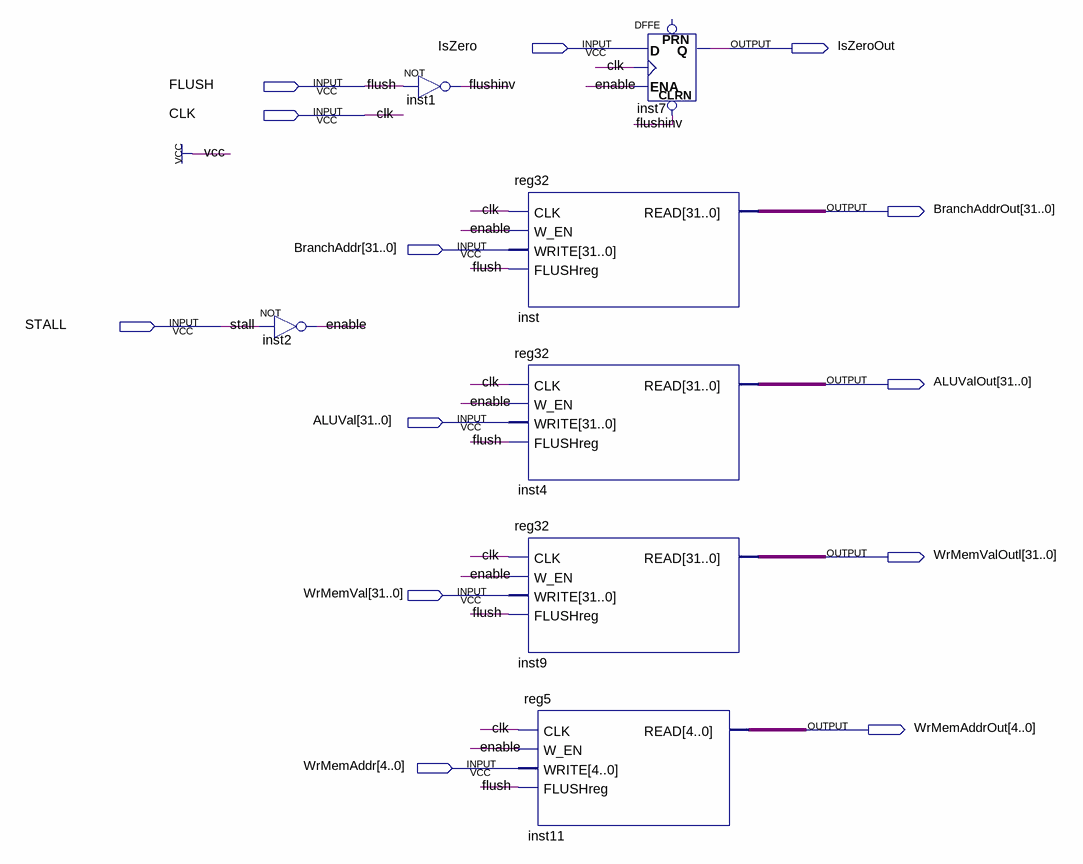
[diagram p0: schematic sheet]
// Quartus schematic EX-MW_barrier.bdf as structural Verilog: 7 symbols, 13 pins
module \EX-MW_barrier  (
  input  IsZero,
  input  FLUSH,
  input  CLK,
  input  [31:0] BranchAddr,
  input  STALL,
  input  [31:0] ALUVal,
  input  [31:0] WrMemVal,
  input  [4:0] WrMemAddr,
  output IsZeroOut,
  output [31:0] BranchAddrOut,
  output [31:0] ALUValOut,
  output [31:0] WrMemValOutl,
  output [4:0] WrMemAddrOut
);

  wire enable, flushinv;

  not inst2 (enable, STALL);
  not inst1 (flushinv, FLUSH);
  reg32 inst (.CLK(CLK), .W_EN(enable), .WRITE(BranchAddr), .FLUSHreg(FLUSH), .READ(BranchAddrOut));
  reg32 inst4 (.CLK(CLK), .W_EN(enable), .WRITE(ALUVal), .FLUSHreg(FLUSH), .READ(ALUValOut));
  reg32 inst9 (.CLK(CLK), .W_EN(enable), .WRITE(WrMemVal), .FLUSHreg(FLUSH), .READ(WrMemValOutl));
  reg5 inst11 (.CLK(CLK), .W_EN(enable), .WRITE(WrMemAddr), .FLUSHreg(FLUSH), .READ(WrMemAddrOut));
  DFFE inst7 (.CLRN(flushinv), .D(IsZero), .CLK(CLK), .ENA(enable), .Q(IsZeroOut));  // open: PRN
endmodule
